# Altium project pmd_davinci_adapter.PrjPcb
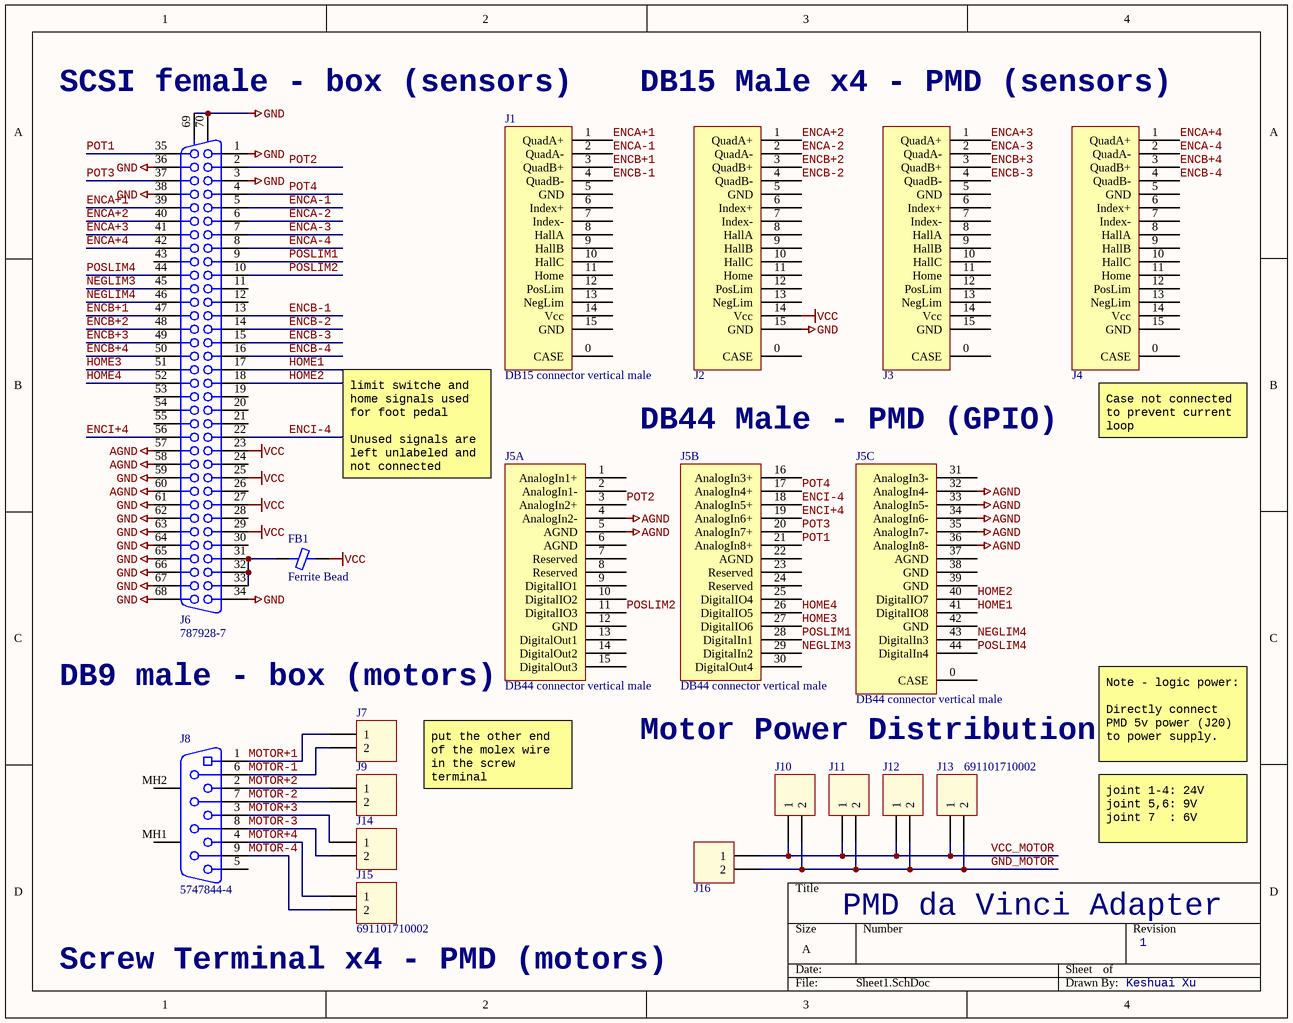
[diagram p0: Sheet1.SchDoc]
1 sheet, 17 parts. Net scope: global (net labels, ports and power ports of the same name join across sheets).
Board file: PCB1.PcbDoc

## Sheet Sheet1.SchDoc
size A

### Parts
FB1  Ferrite Bead  [IND_0603]
J1  DB15 connector vertical male  [10090928-P154XLF]
J2  DB15 connector vertical male  [10090928-P154XLF]  (value not drawn)
J3  DB15 connector vertical male  [10090928-P154XLF]  (value not drawn)
J4  DB15 connector vertical male  [10090928-P154XLF]  (value not drawn)
J5  DB44 connector vertical male  [10090928-P444XLF]  (parts A,B,C of 3)
J6  787928-7  [787928-7]
J7  691101710002  [691101710002]  (value not drawn)
J8  5747844-4  [TE-5747844-4_V]
J9  691101710002  [691101710002]  (value not drawn)
J10  691101710002  [691101710002]  (value not drawn)
J11  691101710002  [691101710002]  (value not drawn)
J12  691101710002  [691101710002]  (value not drawn)
J13  691101710002  [691101710002]
J14  691101710002  [691101710002]  (value not drawn)
J15  691101710002  [691101710002]
J16  691101710002  [691101710002]  (value not drawn)

### Nets
AGND: J5.4(AnalogIn2-) J5.5(AGND) J5.32(AnalogIn4-) J5.33(AnalogIn5-) J5.34(AnalogIn6-) J5.35(AnalogIn7-) J5.36(AnalogIn8-) J6.57 J6.58 J6.60
GND: J2.15(GND) J6.1 J6.3 J6.34 J6.36 J6.38 J6.59 J6.61 J6.62 J6.63 J6.64 J6.65 J6.66 J6.67 J6.68 J6.69(MH1) J6.70(MH2)
VCC: FB1.2 J2.14(Vcc) J6.23 J6.25 J6.27 J6.29
ENCA+1: J1.1(QuadA+) J6.39
ENCA+2: J2.1(QuadA+) J6.40
ENCA+3: J3.1(QuadA+) J6.41
ENCA+4: J4.1(QuadA+) J6.42
ENCA-1: J1.2(QuadA-) J6.5
ENCA-2: J2.2(QuadA-) J6.6
ENCA-3: J3.2(QuadA-) J6.7
ENCA-4: J4.2(QuadA-) J6.8
ENCB+1: J1.3(QuadB+) J6.47
ENCB+2: J2.3(QuadB+) J6.48
ENCB+3: J3.3(QuadB+) J6.49
ENCB+4: J4.3(QuadB+) J6.50
ENCB-1: J1.4(QuadB-) J6.13
ENCB-2: J2.4(QuadB-) J6.14
ENCB-3: J3.4(QuadB-) J6.15
ENCB-4: J4.4(QuadB-) J6.16
ENCI+4: J5.19(AnalogIn6+) J6.56
ENCI-4: J5.18(AnalogIn5+) J6.22
GND_MOTOR: J10.2 J11.2 J12.2 J13.2 J16.2
HOME1: J5.41(DigitalIO8) J6.17
HOME2: J5.40(DigitalIO7) J6.18
HOME3: J5.27(DigitalIO6) J6.51
HOME4: J5.26(DigitalIO5) J6.52
MOTOR+1: J7.1 J8.1
MOTOR+2: J8.2 J9.1
MOTOR+3: J8.3 J14.1
MOTOR+4: J8.4 J15.1
MOTOR-1: J7.2 J8.6
MOTOR-2: J8.7 J9.2
MOTOR-3: J8.8 J14.2
MOTOR-4: J8.9 J15.2
NEGLIM3: J5.29(DigitalIn2) J6.45
NEGLIM4: J5.43(DigitalIn3) J6.46
POSLIM1: J5.28(DigitalIn1) J6.9
POSLIM2: J5.11(DigitalIO3) J6.10
POSLIM4: J5.44(DigitalIn4) J6.44
POT1: J5.21(AnalogIn8+) J6.35
POT2: J5.3(AnalogIn2+) J6.2
POT3: J5.20(AnalogIn7+) J6.37
POT4: J5.17(AnalogIn4+) J6.4
VCC_MOTOR: J10.1 J11.1 J12.1 J13.1 J16.1
NetFB1_1: FB1.1 J6.31 J6.32 J6.33

Not connected (* = marked no-connect by the designer): J1 0(CASE) 5(GND) 6(Index+) 7(Index-) 8(HallA) 9(HallB) 10(HallC) 11(Home) 12(PosLim) 13(NegLim) 14(Vcc) 15(GND); J2 0(CASE) 5(GND) 6(Index+) 7(Index-) 8(HallA) 9(HallB) 10(HallC) 11(Home) 12(PosLim) 13(NegLim); J3 0(CASE) 5(GND) 6(Index+) 7(Index-) 8(HallA) 9(HallB) 10(HallC) 11(Home) 12(PosLim) 13(NegLim) 14(Vcc) 15(GND); J4 0(CASE) 5(GND) 6(Index+) 7(Index-) 8(HallA) 9(HallB) 10(HallC) 11(Home) 12(PosLim) 13(NegLim) 14(Vcc) 15(GND); J5 0(CASE) 1(AnalogIn1+) 2(AnalogIn1-) 6(AGND) 7(Reserved) 8(Reserved) 9(DigitalIO1) 10(DigitalIO2) 12(GND) 13(DigitalOut1) 14(DigitalOut2) 15(DigitalOut3) 16(AnalogIn3+) 22(AGND) 23(Reserved) 24(Reserved) 25(DigitalIO4) 30(DigitalOut4) 31(AnalogIn3-) 37(AGND) 38(GND) 39(GND) 42(GND); J6 11 12 19 20 21 24 26 28 30 43 53 54 55; J8 5 MH1 MH2

### Notes on the sheet
- (near J6) SCSI female - box (sensors)
- DB15 Male x4 - PMD (sensors)
- (near J5) DB44 Male - PMD (GPIO)
- (near J4) Case not connected to prevent current loop
- limit switche and home signals used for foot pedal
  Unused signals are left unlabeled and not connected
- DB9 male - box (motors)
- (near J5) Motor Power Distribution
- Note - logic power:
  Directly connect PMD 5v power (J20) to power supply.
- put the other end of the molex wire in the screw terminal
- joint 1-4: 24V
  joint 5,6: 9V
  joint 7  : 6V
- (near J15) Screw Terminal x4 - PMD (motors)
- PMD da Vinci Adapter
- 1
- Keshuai Xu

### Library data of the parts
FB1 = Ferrite Chip: SMT Ferrite Chip
J1-J4 = PMD-sensor
J5 = PMD-GPIO
J6 = 787928-7: Receptacle Assembly, Shielded, Right Angle, AMPLIMITE; Positions: 68; Note: Series III; Gender: Receptacle Header; Note: With Mating Lock; PCB_Layout: Complies with manufacturer's recommendation.; DrillSize: Corresponds to nominal value.; Published: 17-Jul-2002; DatasheetDocument: 13-Jan-2000; PackageDocument: 13-Jan-2000; PackageReference: 787928-7; Publisher: Altium Limited; Orientation: Right Angle; ComponentLink1Description: Manufacturer Link; ComponentLink1URL: http://www.tycoelectronics.com/; ComponentLink2Description: Packaging Specification; ComponentLink2URL: http://ecommas.tycoelectronics.com/commerce/DocumentDelivery/DDEController?Action=showdoc&DocId=Customer+Drawing%7F787928%7FE%7Fpdf%7FEnglish%7FENG_CD_787928_E.pdf; ComponentLink3Description: URL Link1; ComponentLink3URL: http://catalog.tycoelectronics.com/TE/docs/cadgeo/2/25/41522.tar.gz
J7 J9-J16 = 691101710002: WR-TBL Serie 101 - 5.00 mm Horizontal Entry Modular, 02p; Pitch: 5 mm; ComponentLink1Description: Manufacturer; ComponentLink1URL: http://www.we-online.de; ComponentLink2Description: Datasheet; ComponentLink2URL: http://katalog.we-online.de/em/datasheet/6911017100xx.pdf; Part Number: 691101710002; Published Date: Feb. 2017; Publisher: Wurth Elektronik; Pin Number: 02p
  J7 J9-J15: ClassName: no-clearance-check
  J16: ComponentClass: no-clearance-check
J8 = CMP-1684-00001-6: Female D-Sub Receptacle, Pitch 1.3716 mm, 9 Position, Height 12.9286 mm, -55 to 105 degC, RoHS, Tray; Manufacturer: TE Connectivity; Voltage Rating: 125 V; Current Rating: 6 A; Rows: 2; Mounting Technology: Through Hole; Height: 12.54 mm; Lead Pitch: 2.74 mm; ComponentLink1Description: Manufacturer URL; DatasheetVersion: Rev. P, 03/2011; ComponentLink2Description: Datasheet; REACH SVHC: No SVHC; Max Operating Temperature: 105 degC; Contact Material: Bronze; Mount: Through Hole; Contact Plating: Gold; Colour: Black; ComponentLink1URL: http://www.te.com/; RoHSCompliant: true; Min Operating Temperature: -55 degC; PackageReference: 5747844-4; Contact Finish: Gold; Packaging: Tray; Pins: 9; Length: 30.81 mm; Package Quantity: 130; PackageDescription: Female D-Sub Receptacle, Pitch 1.3716 mm, 9 Position, Height 12.9286 mm; ComponentLink2URL: http://www.te.com/commerce/DocumentDelivery/DDEController?Action=srchrtrv&DocNm=5747844&DocType=Customer+Drawing&DocLang=English